# EAGLE design itsy_bitsy_to_pro_micro (EAGLE 9.2.1)
COMPANY: ADAFRUIT INDUSTRIES; DRAWN: KTOWN; REV: B
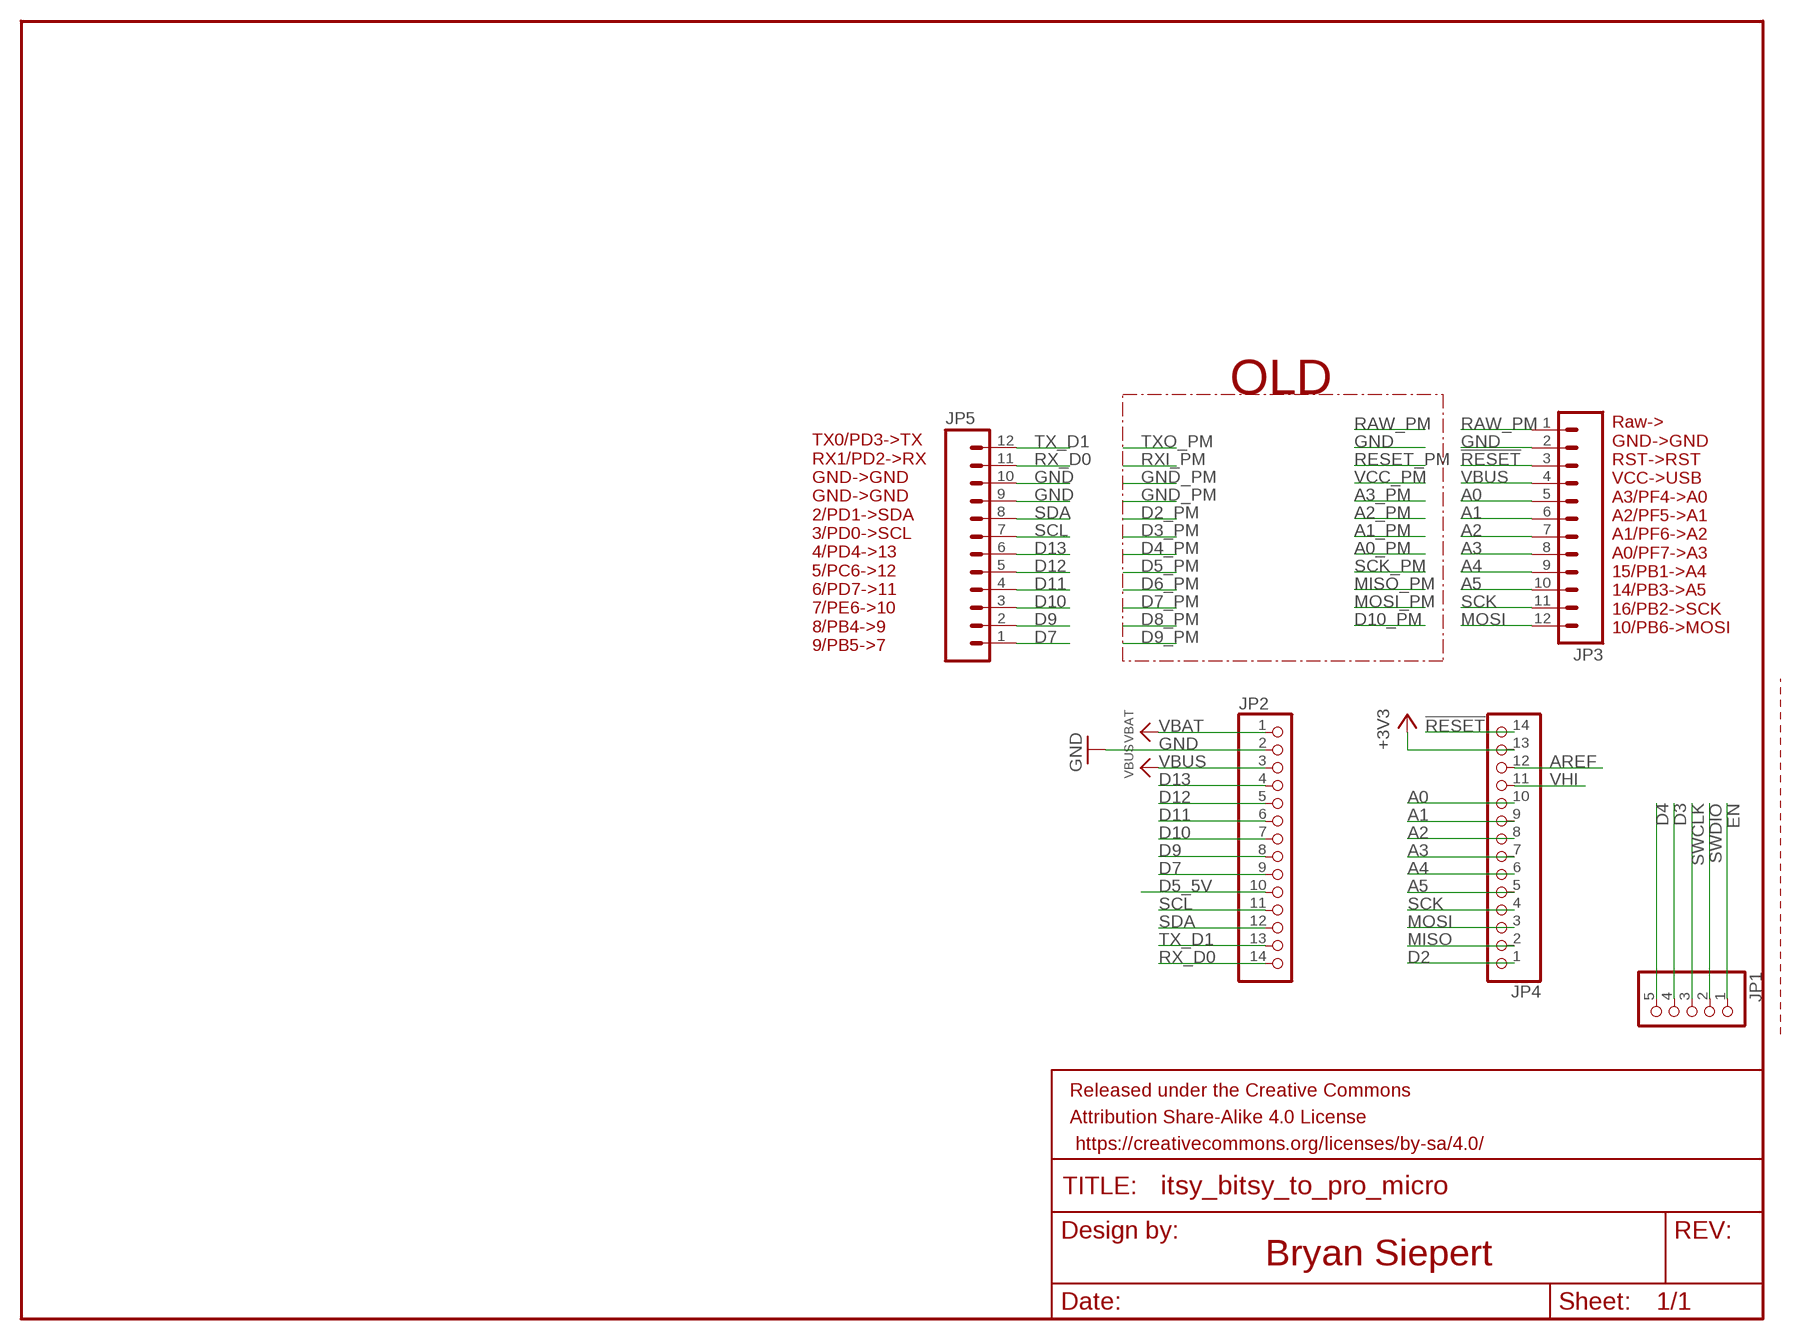
[diagram p0: schematic, sheet 1]

## Parts
FRAME2  FRAME-LETTER  [CREATIVE_COMMONS]
JP1  HEADER-1X570MIL  [1X05_ROUND_70]
JP2  HEADER-1X14  [1X14_ROUND70]
JP3  M12PTH  [1X12]
JP4  HEADER-1X14  [1X14_ROUND70]
JP5  M12PTH  [1X12]

## Nets
!RESET: JP3.3 JP4.14
+3V3: JP4.13
A0: JP3.5 JP4.10
A1: JP3.6 JP4.9
A2: JP3.7 JP4.8
A3: JP3.8 JP4.7
A4: JP3.9 JP4.6
A5: JP3.10 JP4.5
AREF: JP4.12
D2: JP4.1
D3: JP1.4
D4: JP1.5
D5_5V: JP2.10
D7: JP2.9 JP5.1
D9: JP2.8 JP5.2
D10: JP2.7 JP5.3
D11: JP2.6 JP5.4
D12: JP2.5 JP5.5
D13: JP2.4 JP5.6
EN: JP1.1
GND: JP2.2 JP3.2 JP5.9 JP5.10
MISO: JP4.2
MOSI: JP3.12 JP4.3
RAW_PM [vcc]: JP3.1
RX_D0: JP2.14 JP5.11
SCK: JP3.11 JP4.4
SCL: JP2.11 JP5.7
SDA: JP2.12 JP5.8
SWCLK: JP1.3
SWDIO: JP1.2
TX_D1: JP2.13 JP5.12
VBAT: JP2.1
VBUS: JP2.3 JP3.4
VHI: JP4.11

## Notes on the sheet
- OLD
- Raw->
  GND->GND
  RST->RST
  VCC->USB
  A3/PF4->A0
  A2/PF5->A1
  A1/PF6->A2
  A0/PF7->A3
  15/PB1->A4
  14/PB3->A5
  16/PB2->SCK
  10/PB6->MOSI
- TX0/PD3->TX
  RX1/PD2->RX
  GND->GND
  GND->GND
  2/PD1->SDA
  3/PD0->SCL
  4/PD4->13
  5/PC6->12
  6/PD7->11
  7/PE6->10
  8/PB4->9
  9/PB5->7
- Bryan Siepert

## Library data of the parts
FRAME2 = SparkFun-Aesthetics:FRAME-LETTER: Schematic Frame - Letter Standard 8.5x11 US Letter frame
JP1 = microbuilder:HEADER-1X5: PIN HEADER
JP2 JP4 = microbuilder:HEADER-1X14
JP3 JP5 = SparkFun:M12: Header 12 Standard 12-pin 0.1" header. Use with straight break away headers (SKU : PRT-00116), right angle break away headers (PRT-00553), swiss pins (PRT-00743), machine pins (PRT-00117), and female headers (PRT-00115).

## Net classes
0 default: width 0.203 mm

## Board
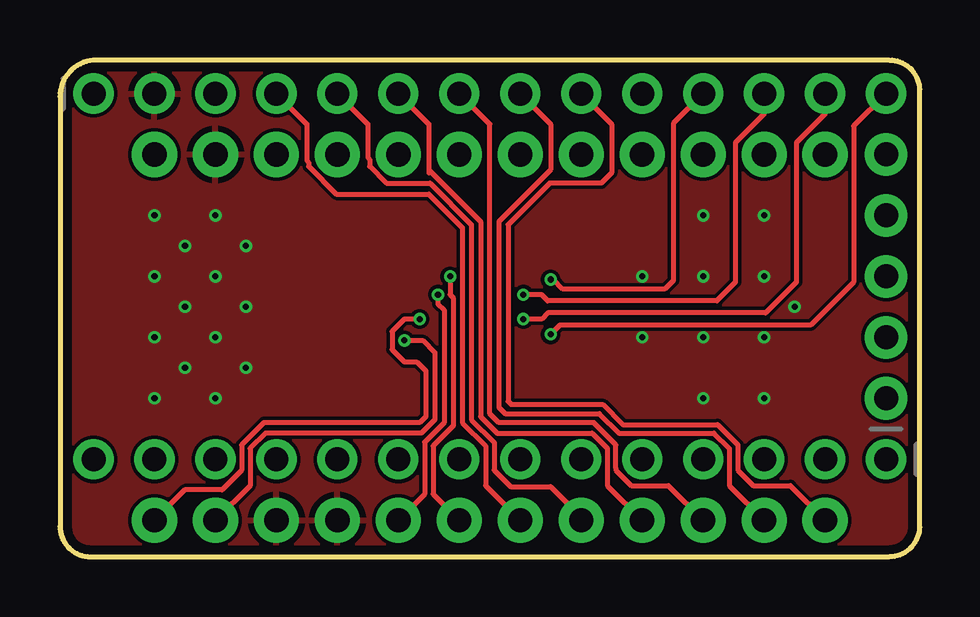
[diagram p1: board, top side]
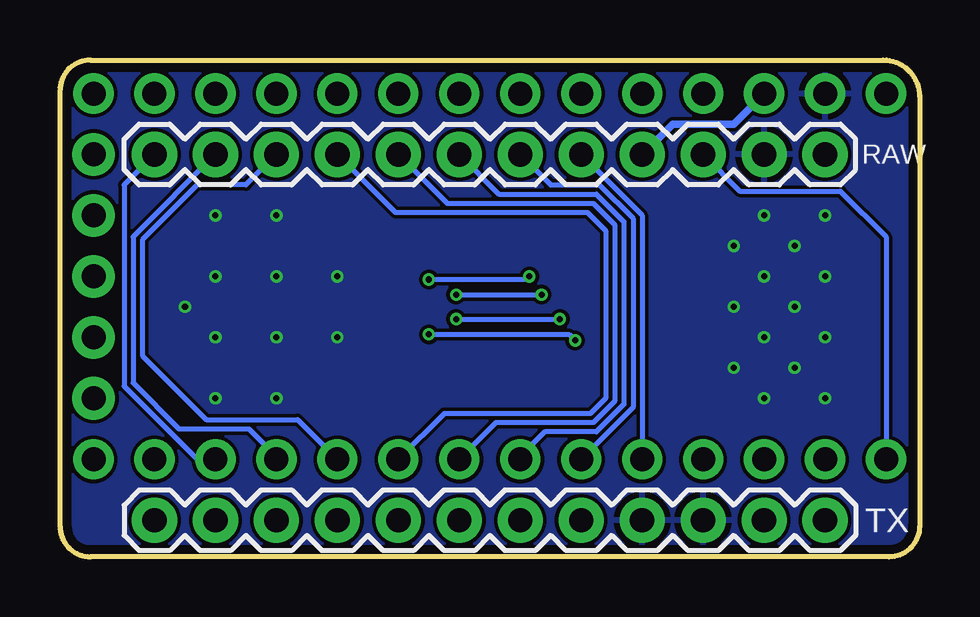
[diagram p2: board, bottom side, seen from below]

Size 35.81 x 20.7 mm. Coordinates in mm from the lower left corner, seen from the top.
Outline: 1.27,0 34.54,0 arc90 35.81,1.27 35.81,19.43 arc90 34.54,20.7 1.52,20.7 arc90 0,19.18 0,1.27 arc90 1.27,0
Copper layers (1*16): Top 0.035559375mm / dielectric 1.6mm / Bottom 0.035559375mm
Design rules "oshpark-2layer-tented": minimum track width 6mil, minimum drill 10mil, track to track 6mil, track to pad 6mil, pad to pad 6mil, via to via 6mil, smd to smd 6mil, copper to edge 15mil, drill to drill 6mil, minimum pad ring 5mil, minimum via ring 5mil, stop-mask expansion 2.5mil, vias tented up to drill 20mil, thermal gap 10mil

### Footprints (pad centres in the part's own frame; a part is rotated, then mirrored left to right if it is on the bottom)
1X05_ROUND_70 = drill 1 pad 1.778: 1 -5.08,0; 2 -2.54,0; 3 0,0; 4 2.54,0; 5 5.08,0
1X14_ROUND70 = drill 1 pad 1.676: 1 -16.51,0; 2 -13.97,0; 3 -11.43,0; 4 -8.89,0; 5 -6.35,0; 6 -3.81,0; 7 -1.27,0; 8 1.27,0; 9 3.81,0; 10 6.35,0; 11 8.89,0; 12 11.43,0; 13 13.97,0; 14 16.51,0
1X12 = drill 1.016 pad 1.88: 1 0,0; 2 2.54,0; 3 5.08,0; 4 7.62,0; 5 10.16,0; 6 12.7,0; 7 15.24,0; 8 17.78,0; 9 20.32,0; 10 22.86,0; 11 25.4,0; 12 27.94,0

### Placement (x,y rotation side)
FRAME2  16.76,-9.4 0 top  (outside the outline)
JP1  34.42,11.68 90 top
JP2  17.91,19.3 0 top
JP3  3.94,16.76 180 bottom
JP4  17.91,4.06 180 top
JP5  31.88,1.52 0 bottom

### Tracks (layer width: path | path; a pad name or v marks a point on that pad's centre or on a via)
!RESET
  Bottom 0.203: JP3.3 7.49,15.24 3.3,15.24 1.4,13.34 JP4.14
A0
  Bottom 0.203: JP3.5 11.56,14.22 JP4.10
A1
  Bottom 0.203: JP3.6 15.37,15.49 13.34,15.49 11.94,14.1 11.94,6.22 JP4.9
A2
  Bottom 0.203: JP3.7 17.53,15.11 13.46,15.11 12.32,13.97 12.32,6.35 13.46,5.21 15.62,5.21 16.64,4.19 JP4.8
A3
  Bottom 0.203: JP3.8 19.68,14.73 13.59,14.73 12.7,13.84 12.7,6.48 13.59,5.59 17.65,5.59 JP4.7
A4
  Bottom 0.203: JP3.9 21.84,14.35 13.84,14.35 13.08,13.59 13.08,6.6 13.72,5.97 19.81,5.97 JP4.6
A5
  Bottom 0.203: JP3.10 28.07,15.49 30.1,15.49 32.38,13.21 32.38,8.38 29.72,5.71 25.91,5.71 JP4.5
D7
  Top 0.203: JP2.9 22.99,18.03 22.99,16 22.55,15.57 20.4,15.57 18.67,13.84 18.67,6.48 18.8,6.35 22.61,6.35 23.44,5.51 27.4,5.51 28.25,4.66 28.25,3.61 28.89,2.97 30.43,2.97 JP5.1
D9
  Top 0.203: JP2.8 20.45,18.03 20.45,16.13 18.29,13.97 18.29,6.22 18.54,5.97 22.48,5.97 23.29,5.16 27.25,5.16 27.89,4.52 27.89,2.97 JP5.2
D10
  Top 0.203: JP2.7 17.91,18.03 17.91,5.97 18.29,5.59 22.24,5.59 23.16,4.66 23.16,3.68 | 23.16,3.68 | 23.16,3.68 23.16,3.61 23.8,2.97 25.35,2.97 JP5.3
D11
  Top 0.203: JP2.6 15.37,18.03 15.37,16.13 | 15.37,16.13 15.37,16 | 15.37,16.13 17.53,13.97 17.53,5.84 18.21,5.16 22.17,5.16 22.81,4.52 22.81,2.97 JP5.4
D12
  Top 0.203: JP2.5 12.83,18.03 12.83,16.64 12.9,16.56 12.9,16.27 13.6,15.57 15.42,15.57 17.14,13.84 17.14,10.16 17.14,5.71 18.09,4.78 18.09,3.61 18.77,2.92 20.45,2.92 21.72,1.65 JP5.5
D13
  Top 0.203: JP2.4 10.29,18.03 10.29,16.51 10.36,16.43 10.36,16.27 11.52,15.11 15.37,15.11 16.76,13.72 16.76,5.59 17.73,4.62 17.73,2.97 JP5.6
GND  (via drill 0.25)
  other vias: 3.94,14.22 3.94,6.6 5.21,12.95 3.94,11.68 5.21,10.41 3.94,9.14 5.21,7.87 6.48,14.22 7.75,12.95 6.48,11.68 7.75,10.41 6.48,9.14 7.75,7.87 6.48,6.6 29.34,14.22 26.8,14.22 26.8,11.68 29.34,11.68 26.8,9.14 29.34,9.14 26.8,6.6 29.34,6.6 30.61,10.41 24.26,11.68 24.26,9.14
  pour Top: -0.38,21.34 36.7,21.34 36.7,-1.02 -0.38,-1.02
  pour Bottom: -0.76,21.97 37.59,21.97 37.59,-1.78 -0.76,-1.78
MOSI
  Bottom 0.203: JP3.12 33.15,15.49 33.15,7.11 30.1,4.06 JP4.3
RX_D0  (via drill 0.25)
  Top 0.203: JP2.14 33.07,17.96 33.07,11.44 31.28,9.65 20.83,9.65 v20.45,9.27 | v14.35,9.02 15.11,9.02 15.62,8.51 15.62,5.71 15.06,5.16 8.56,5.16 7.93,4.52 7.93,2.97 JP5.11
  Bottom 0.203: v20.45,9.27 14.61,9.27 v14.35,9.02
SCK
  Bottom 0.203: JP3.11 32.77,13.34 32.77,7.24 30.86,5.33 27.94,5.33 26.8,4.19 JP4.4
SCL  (via drill 0.25)
  Top 0.203: JP2.11 25.55,18.06 25.55,11.51 25.19,11.15 20.96,11.15 20.55,11.56 v20.45,11.56 | v16.26,11.68 16.26,10.92 16.38,10.79 16.38,5.46 15.55,4.62 15.55,2.62 JP5.7
  Bottom 0.203: v20.45,11.56 16.38,11.56 v16.26,11.68
SDA  (via drill 0.25)
  Top 0.203: JP2.12 29.34,18.45 28.14,17.26 28.14,11.44 27.37,10.67 20.32,10.67 20.07,10.92 v19.3,10.92 | v15.75,10.92 15.75,10.54 16,10.29 16,5.59 15.19,4.78 15.19,2.62 JP5.8
  Bottom 0.203: v19.3,10.92 v15.75,10.92
TX_D1  (via drill 0.25)
  Top 0.203: JP2.13 31.88,18.45 30.68,17.26 30.68,11.44 29.4,10.16 20.32,10.16 20.07,9.91 v19.3,9.91 | v14.99,9.91 14.35,9.91 13.84,9.4 13.84,8.64 14.35,8.13 14.86,8.13 15.24,7.75 15.24,5.84 14.99,5.59 8.49,5.59 7.57,4.66 7.57,3.61 6.75,2.79 5.21,2.79 JP5.12
  Bottom 0.203: v19.3,9.91 v14.99,9.91
VBUS
  Bottom 0.305: JP2.3 7.75,18.03 10.29,18.03 JP3.4

### Text on the board
bPlace: RAW | TX
tDocu: Bryan Siepert